# Altium schematic sheet Power Supply.SchDoc
size A4
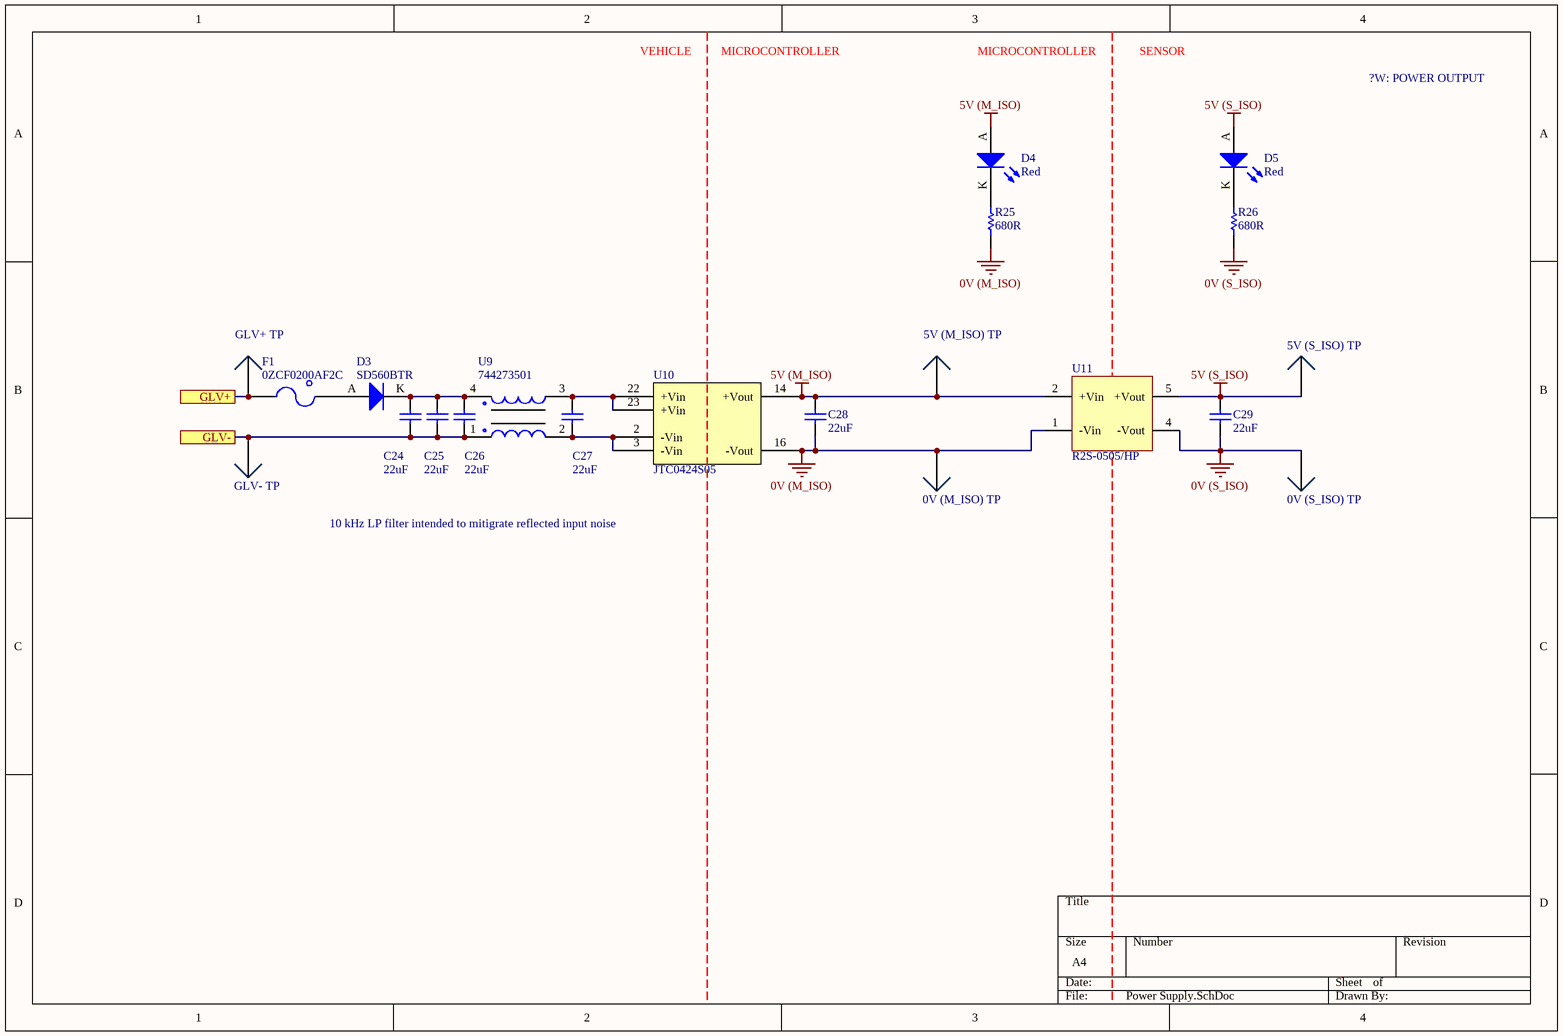
[diagram p0: Power Supply.SchDoc]

## Parts
0V_(M_ISO)_TP  0mm  [SMD Test Point]  (value not drawn)
0V_(S_ISO)_TP  0mm  [SMD Test Point]  (value not drawn)
5V_(M_ISO)_TP  0mm  [SMD Test Point]  (value not drawn)
5V_(S_ISO)_TP  0mm  [SMD Test Point]  (value not drawn)
C24  22uF  [1206]
C25  22uF  [1206]
C26  22uF  [1206]
C27  22uF  [1206]
C28  22uF  [1206]
C29  22uF  [1206]
D3  SD560BTR  [SMB Diode]
D4  Red  [0805 LED]
D5  Red  [0805 LED]
F1  0ZCF0200AF2C  [2920]
GLV+_TP  0mm  [SMD Test Point]  (value not drawn)
GLV-_TP  0mm  [SMD Test Point]  (value not drawn)
R25  680R  [0805]
R26  680R  [0805]
U9  744273501  [Wurth 4-PC Pad]
U10  JTC0424S05  [24-DIP Module, 7 Leads]
U11  R2S-0505/HP  [RECOM 8-SMD (5 Pin)]

## Ports
GLV+, GLV-

## Nets
0V (M_ISO): 0V_(M_ISO)_TP.1 C28.1 R25.1 U10.16(-Vout) U11.1(-Vin)
0V (S_ISO): 0V_(S_ISO)_TP.1 C29.1 R26.1 U11.4(-Vout)
5V (M_ISO): 5V_(M_ISO)_TP.1 C28.2 D4.A U10.14(+Vout) U11.2(+Vin)
5V (S_ISO): 5V_(S_ISO)_TP.1 C29.2 D5.A U11.5(+Vout)
GLV+: F1.1 GLV+_TP.1 ; port GLV+
GLV-: C24.1 C25.1 C26.1 GLV-_TP.1 U9.1 ; port GLV-
NetC24_2: C24.2 C25.2 C26.2 D3.K U9.4
NetC27_1: C27.1 U9.2 U10.2(-Vin) U10.3(-Vin)
NetC27_2: C27.2 U9.3 U10.22(+Vin) U10.23(+Vin)
NetD3_A: D3.A F1.2
NetD4_K: D4.K R25.2
NetD5_K: D5.K R26.2

## Notes on the sheet
- VEHICLE
- MICROCONTROLLER
- SENSOR
- ?W: POWER OUTPUT
- 10 kHz LP filter intended to mitigrate reflected input noise

## Library data of the parts
0V_(M_ISO)_TP 0V_(S_ISO)_TP 5V_(M_ISO)_TP 5V_(S_ISO)_TP GLV+_TP GLV-_TP = SMD Test Point: Positions: 1; Row Spacing: 0; Flange: No; Contact: NA; Part Number: SMD Test Point; Pitch: 0mm; Angle: 0
C24-C29 = CC1206MKX5R7BB226: Manufacturer: YAGEO; Tolerance: 20%; Material: Ceramic; Rated Voltage: 16V; Part Number: CC1206MKX5R7BB226; Value: 22uF; Digikey Part Number: 311-1997-2-ND
D3 = SD560BTR: 1.2V_F 600V 5A SMB; Manufacturer: SMC Diode Solutions; Part Number: SD560BTR; Digikey Part Number: 1655-1530-2-ND; Digikey Link: https://www.digikey.com/product-detail/en/smc-diode-solutions/SD560BTR/1655-1530-2-ND/6022620
D4 D5 = SML-210LTT86: Red LED Indication - Discrete 1.75V 0805 (2012 Metric); Manufacturer: ROHM Semiconductor; Part Number: SML-210LTT86; Colour: Red; Digikey Part Number: 511-1286-1-ND; Digikey Link: https://www.digikey.com/product-detail/en/rohm-semiconductor/SML-210LTT86/511-1286-1-ND/637099
F1 = 0ZCF0200AF2C: SMD 24V 2A Fuse; Manufacturer: Bel Fuse Inc; Part Number: 0ZCF0200AF2C; Digikey Part Number: 507-1749-2-ND; Digikey Link: https://www.digikey.com/product-detail/en/bel-fuse-inc/0ZCF0200AF2C/507-1749-2-ND/4156090
R25 R26 = RC0805FR07680RL: Manufacturer: YAGEO; Tolerance: 0.01; Rated Voltage: 0.125W; Part Number: RC0805FR07680RL; Value: 680R; Material: FR-07
U9 = 744273501: 5µH @ 100kHz 2 Line Common Mode Choke Surface Mount 500 Ohms @ 130MHz 5A DCR 5.5mOhm; Manufacturer: Wurth Electronics Inc; Part Number: 744273501; Inductance: 5µH @ 100kHz; Impedence: 500 Ohms @ 130MHz; Material: Wirewound; Rated Current: 5A; Digikey Part Number: 732-2214-6-ND; Digikey Link: https://www.digikey.com/product-detail/en/w-rth-elektronik/744273501/732-2214-6-ND/2175826
U10 = JTC0424S05: DC DC CONVERTER 5V 4W; Manufacturer: XP Power; Input Voltage: 9V-36V; Efficiency: 0.79; Isolation: Isolated; Part Number: JTC0424S05; Output Voltage: 5V; Output Power: 4W; Digikey Part Number: JTC0424S05-ND; Digikey Link: https://www.digikey.com/products/en?keywords=%20JTC0424S05
U11 = R2S-0505/HP: Isolated Module DC DC Converter 1 Output 3.3V 606mA 4.5V - 5.5V Input; Manufacturer: Recom; Output Voltage: 5V; Output Power: 2W; Efficiency: 0.85; Part Number: R2S-0505/HP; Input Voltage: 4.5V-5.5V; Isolation: Isolated; Digikey Part Number: 945-1764-5-ND; Digikey Link: https://www.digikey.com/product-detail/en/recom-power/R2S-0505-HP/945-1764-5-ND/2302761